# EAGLE board microDriver_v2 (EAGLE 8.3.1), part 1 of 2
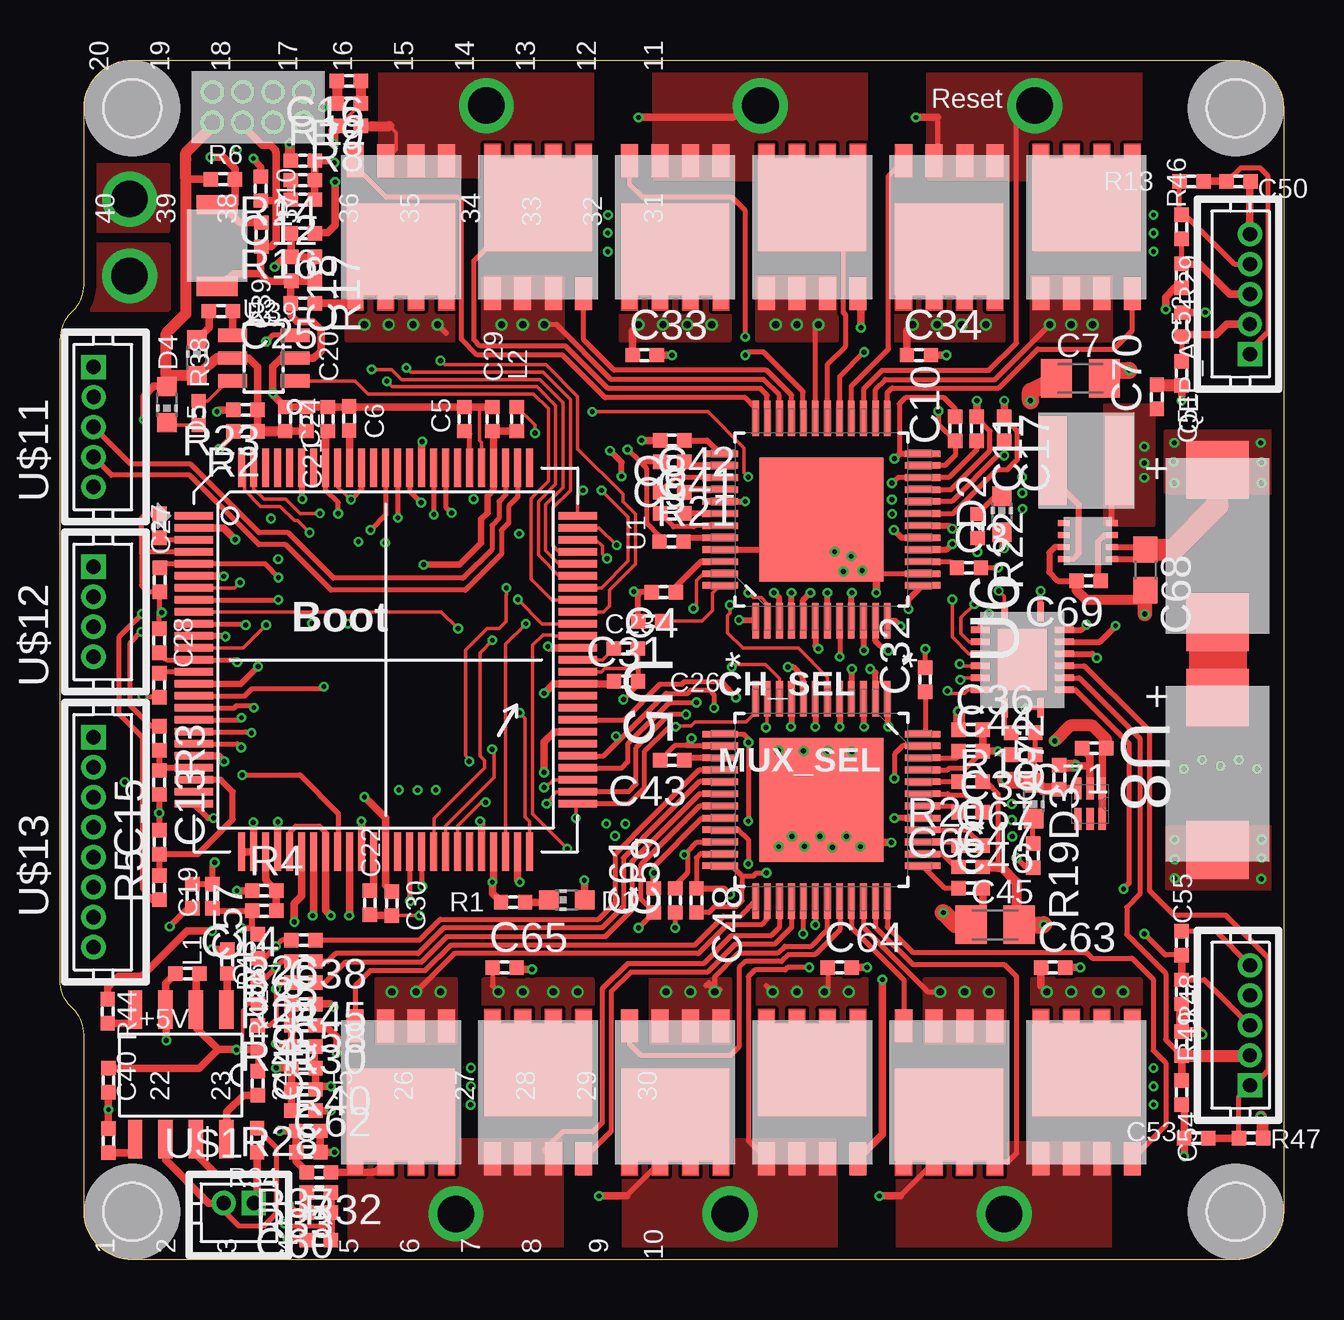
[diagram p3: board, top side]
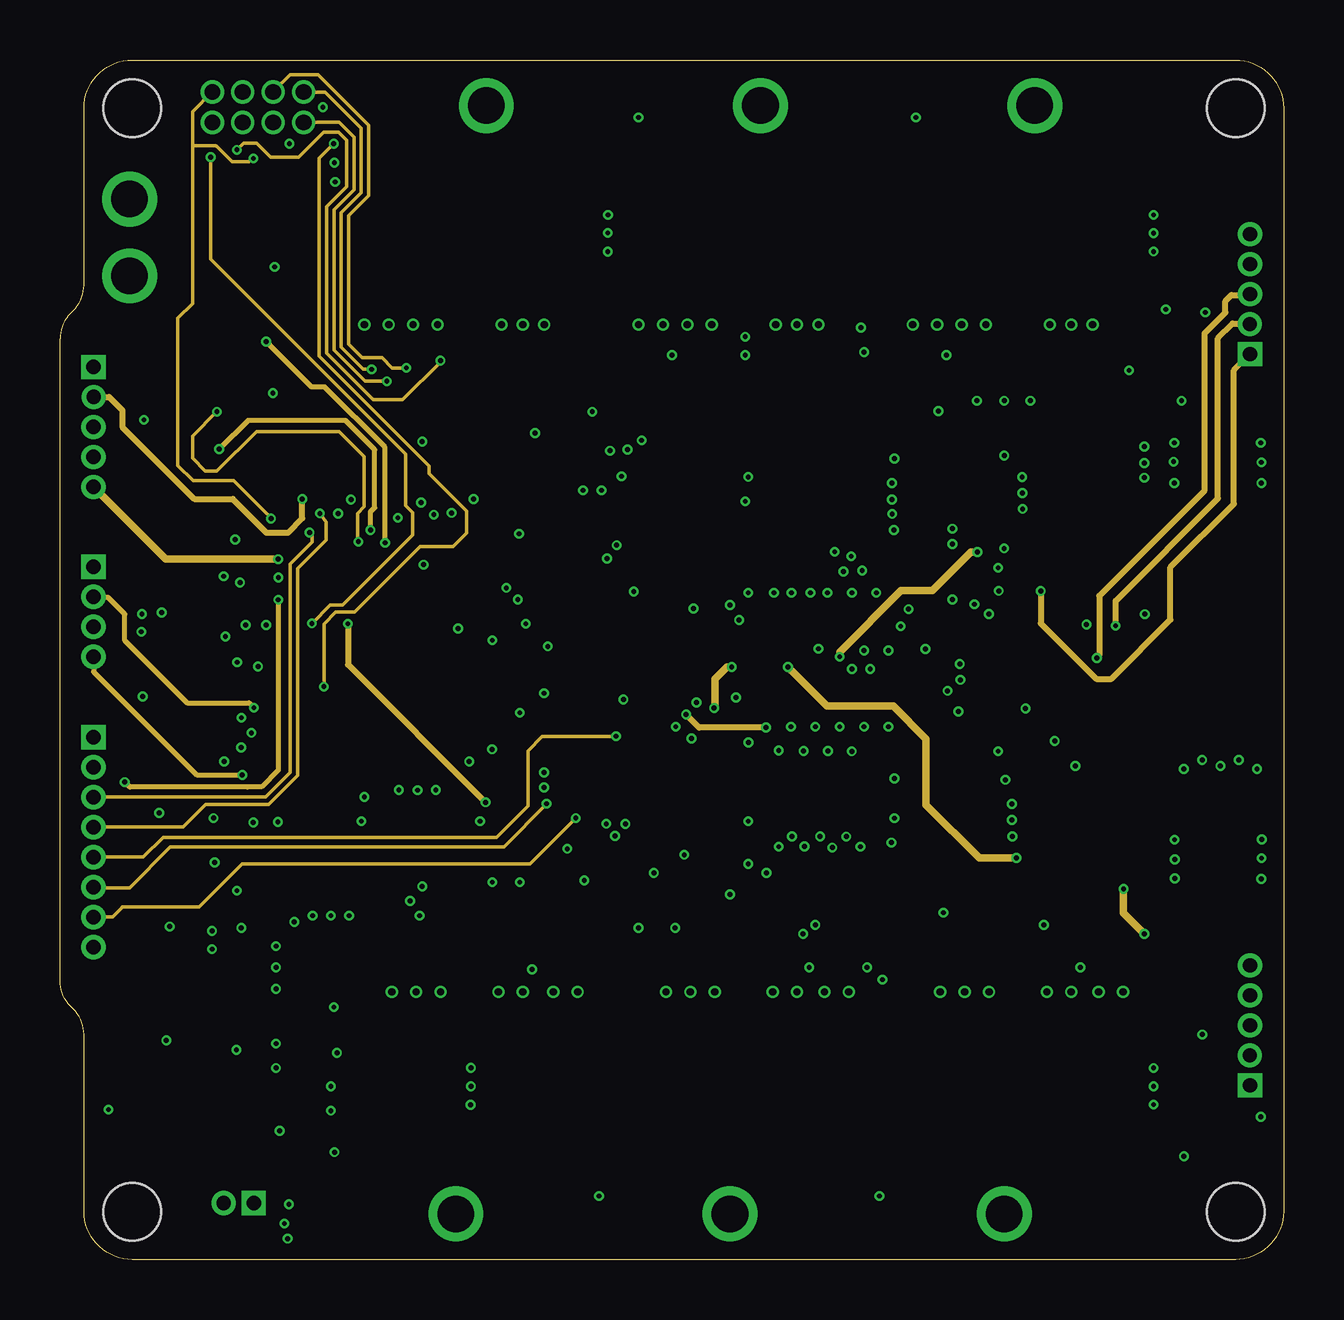
[diagram p4: board, inner layer ROUTE]
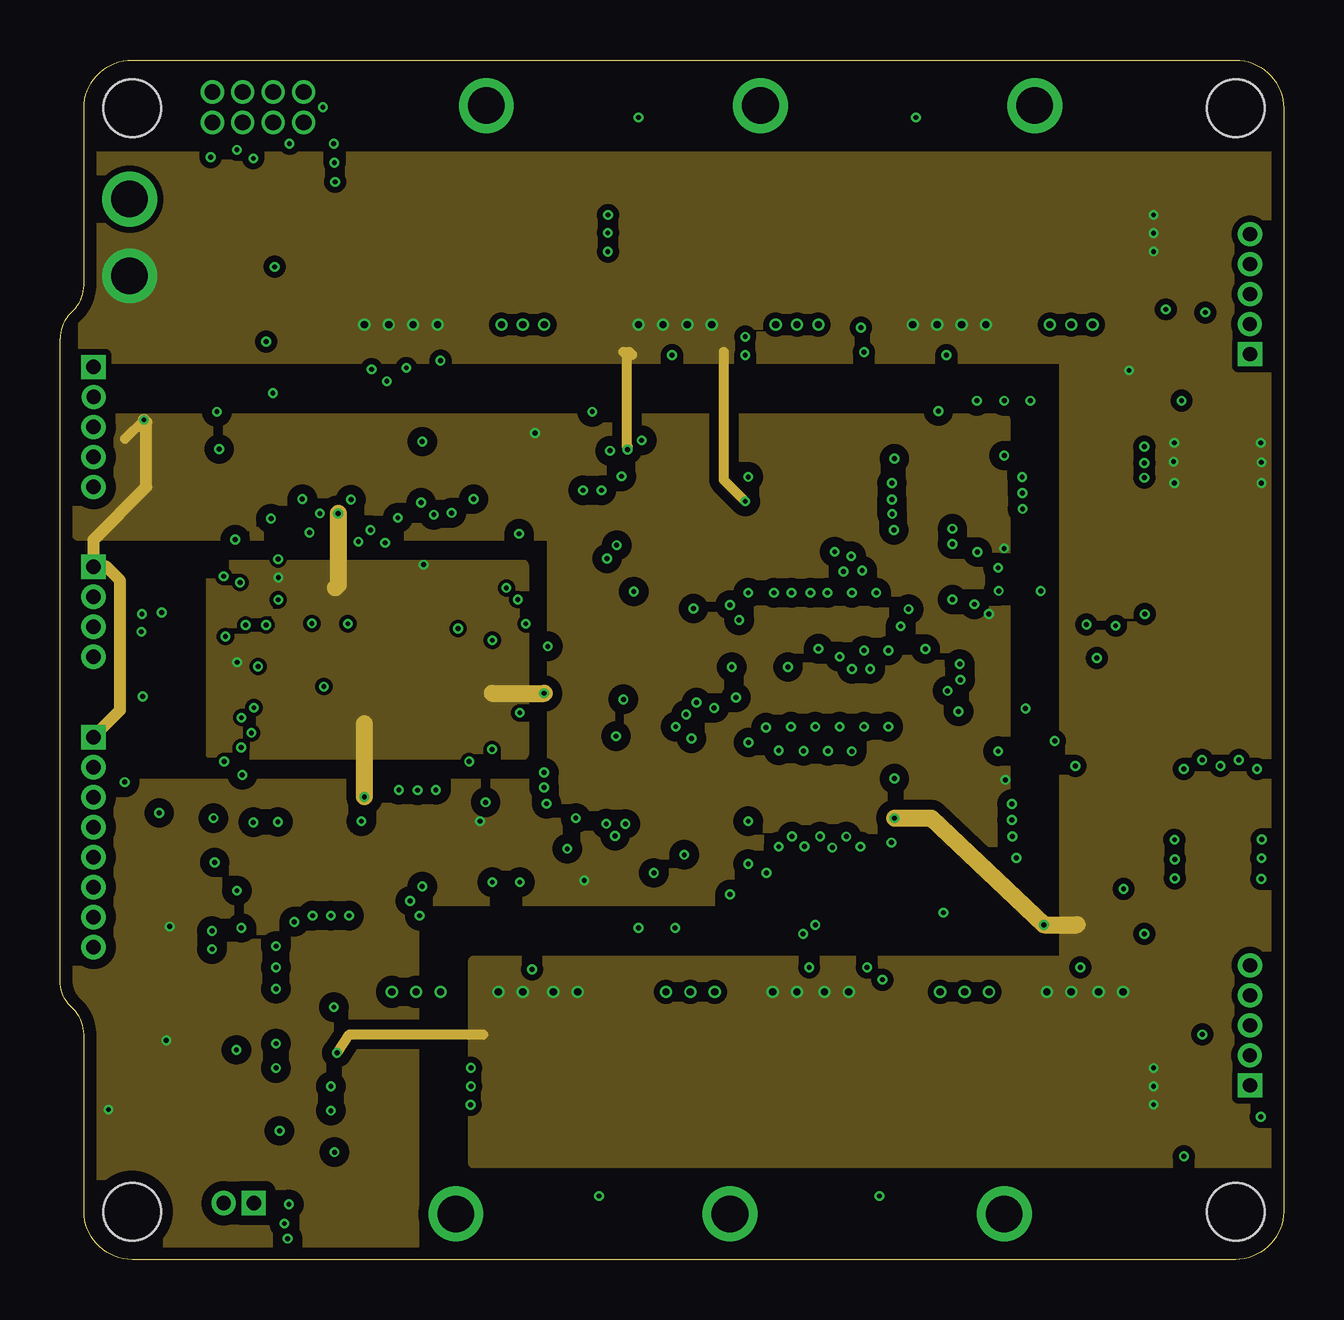
[diagram p5: board, inner layer VDD]
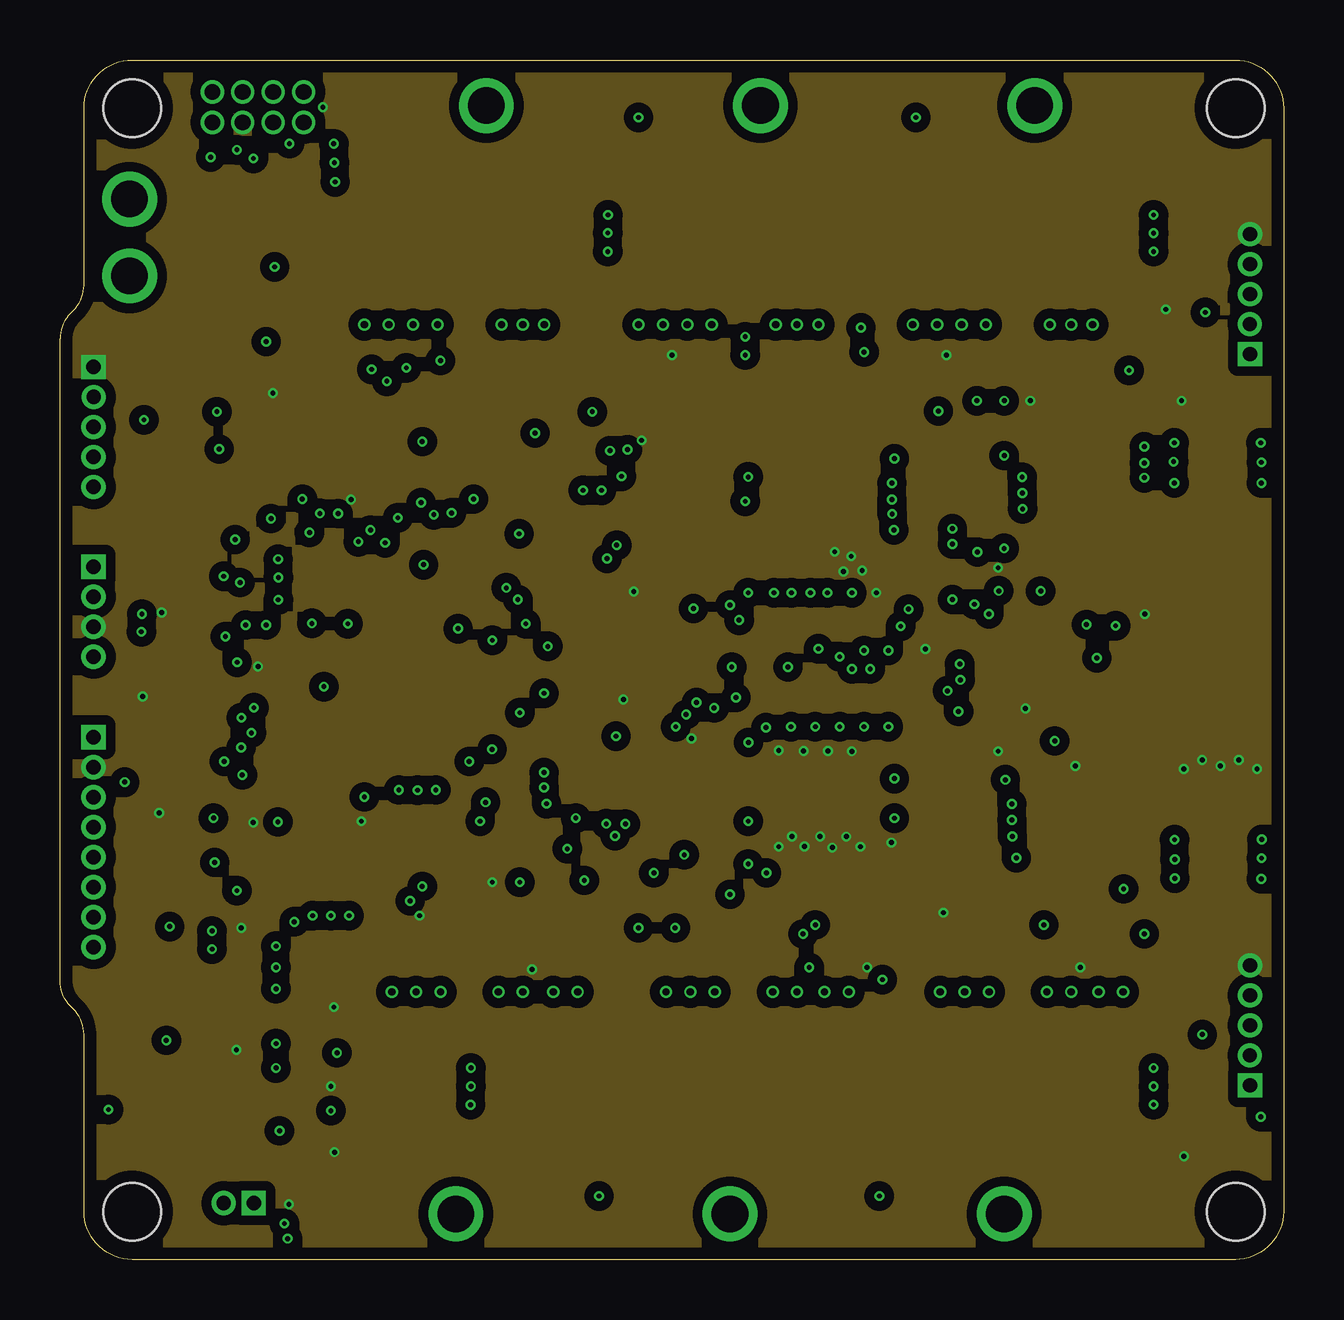
[diagram p6: board, inner layer GND]
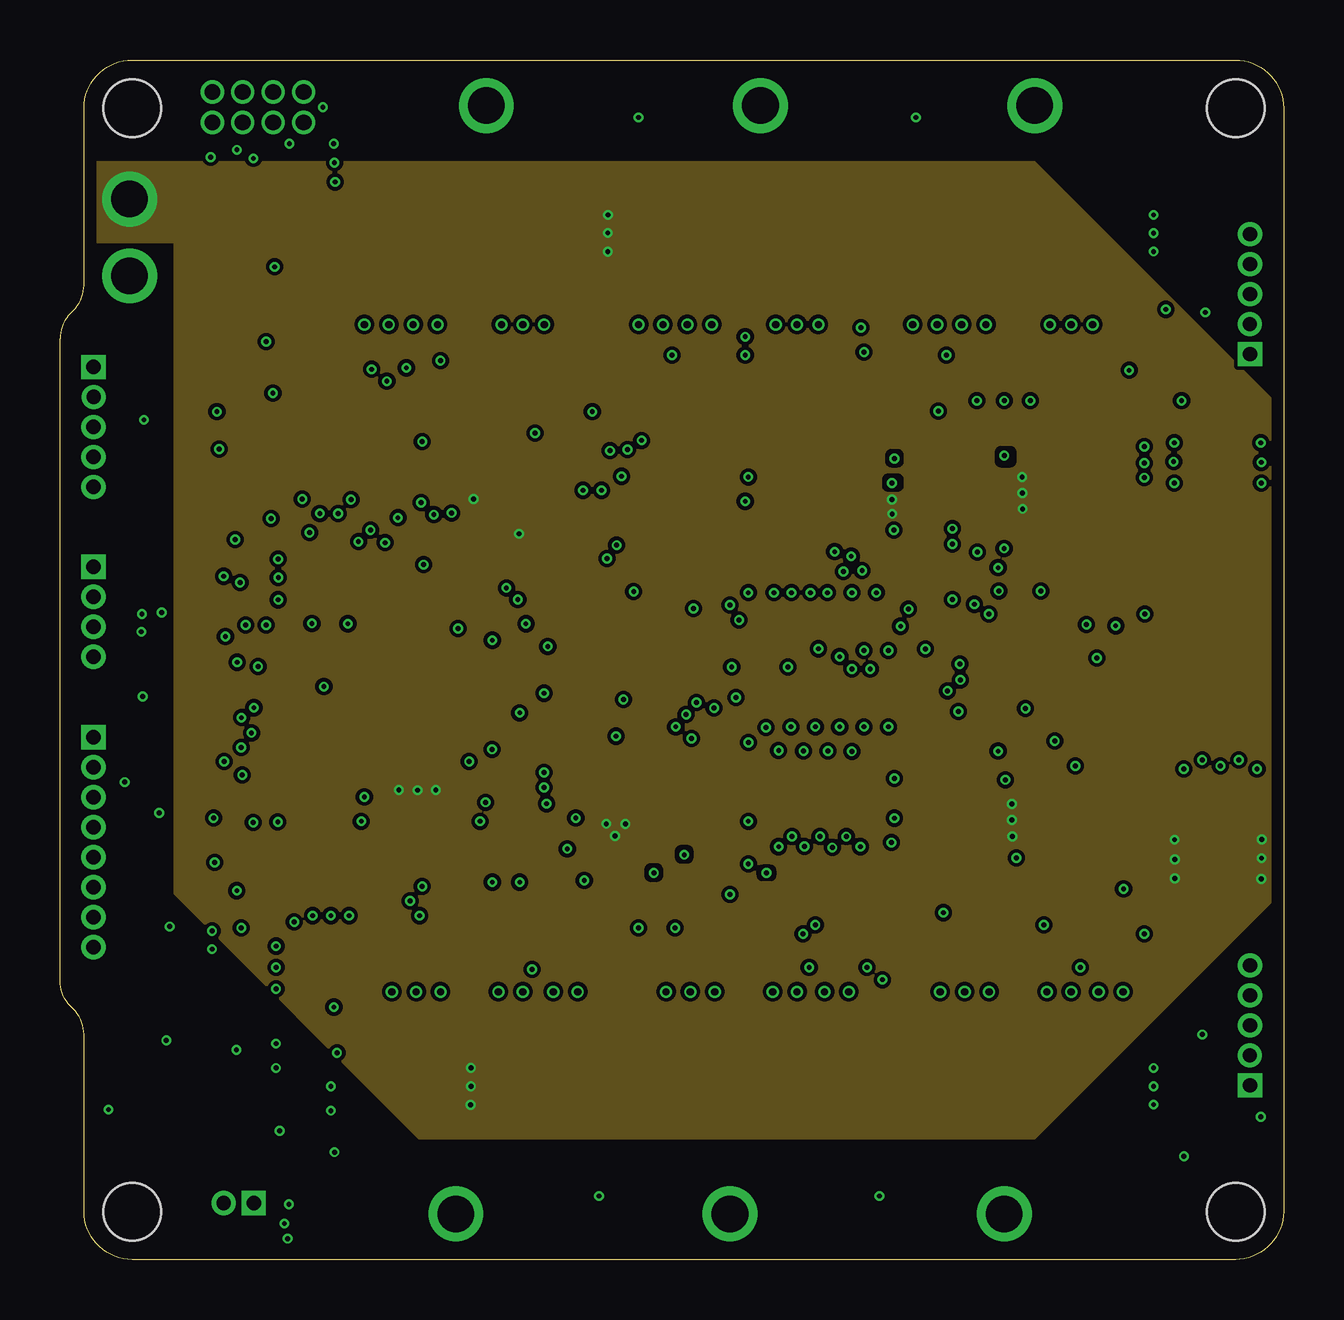
[diagram p7: board, inner layer AGND]
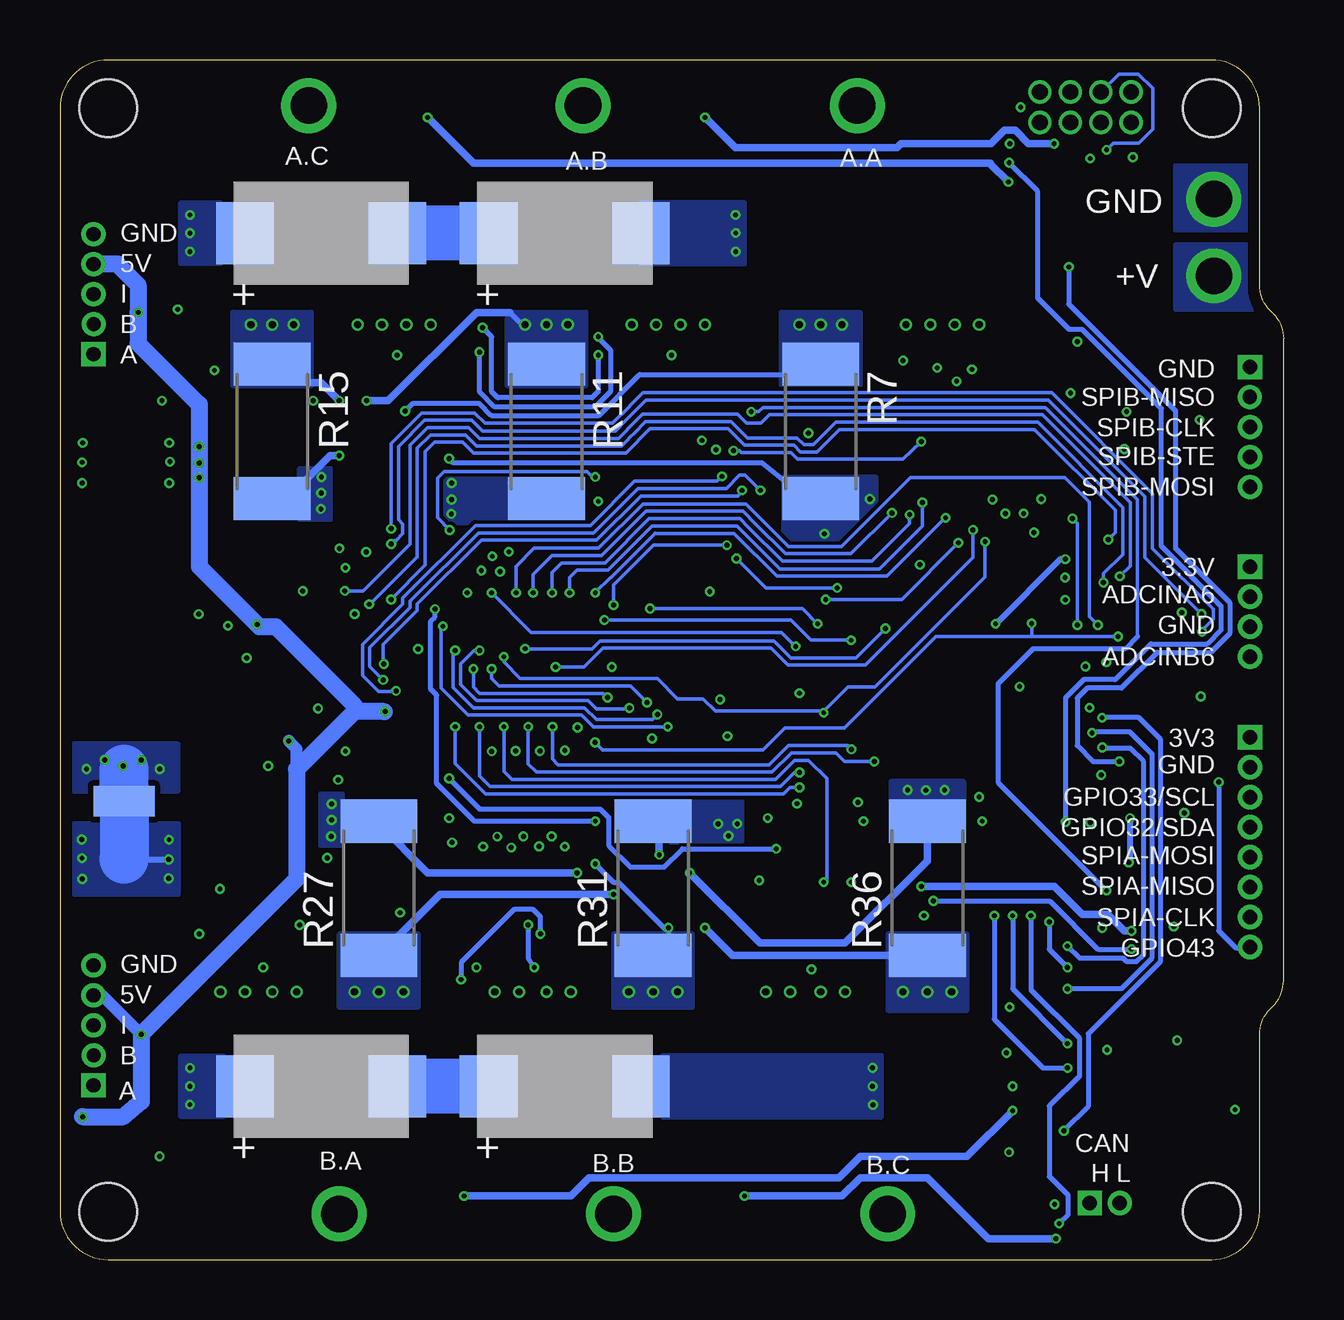
[diagram p8: board, bottom side, seen from below]

Size 51 x 50 mm. Coordinates in mm from the lower left corner, seen from the top.
Outline: 3,50 49,50 arc-90 51,48 51,2 arc-90 49,0 3,0 arc-90 1,2 1,9.38 arc45 0.56,10.44 0.44,10.56 arc-45 0,11.62 0,38.38 arc-45 0.44,39.44 0.56,39.56 arc45 1,40.62 1,48 arc-90 3,50
Copper layers (1*2*3*4*(5*16)): Top 0.035mm / dielectric 0.3mm / ROUTE 0.035mm / dielectric 0.3mm / VDD 0.035mm / dielectric 0.3mm / GND 0.035mm / dielectric 0.15mm / AGND 0.035mm / dielectric 0.2mm / Bottom 0.035mm
Design rules "default *": minimum track width 6mil, minimum drill 6mil, track to track 6mil, track to pad 6mil, pad to pad 5mil, via to via 8mil, smd to smd 5mil, copper to edge 20mil, drill to drill 10mil, minimum pad ring 3mil, minimum via ring 4mil, stop-mask expansion 2.5mil, vias tented up to drill 12mil, thermal gap 10mil
Net classes: 0 default: width 0.152 mm, drill 0.203 mm, clearance 0.152 mm
Holes 2.4 mm at 49,48 49,2 3,48 3,2

## Footprints (pad centres in the part's own frame; a part is rotated, then mirrored left to right if it is on the bottom)
B3U = smd 0.8 x 1.7: P$1 -1.7,0; P$2 1.7,0
C0402 = smd 0.6 x 0.6: 1 -0.5,0; 2 0.5,0
C0805K = smd 1.3 x 1.6: 1 -1,0; 2 1,0
C0603 = smd 1.1 x 1: 1 -0.85,0; 2 0.85,0
CHIP-LED0603 = smd 0.8 x 0.8: A 0,-0.75; C 0,0.75
4X4 = smd 1.2 x 3.7: P$1 -1.4,0; P$2 1.4,0
R0402 = smd 0.6 x 0.6: 1 -0.5,0; 2 0.5,0
AMP-MINITEK-8 = drill 0.65 pad 0.9: P$1 0,0; P$2 0,-1.27; P$3 1.27,0; P$4 1.27,-1.27; P$5 2.54,0; P$6 2.54,-1.27; P$7 3.81,0; P$8 3.81,-1.27
Q5B = smd 1.372 x 0.71: 1 2.77,-1.905; 2 2.77,-0.638; 3 2.77,0.638; 4 2.77,1.905 | smd 0.97 x 0.635: 5 -2.92,1.905; 6 -2.92,0.635; 7 -2.92,-0.635; 8 -2.92,-1.905 | smd 3.81 x 4.52: 9 -0.921,0
DF13-5P-1.25DSA = drill 0.6 pad 1.016 square: P$1 2.5,0.005 | drill 0.6 pad 1.016: P$2 1.25,-0.005; P$3 0,0; P$4 -1.25,0; P$5 -2.5,0
R2512 = smd 1.8 x 3.2: 1 -2.8,0; 2 2.8,0
M7343-CAP = smd 2.4 x 2.6: + -3.175,0; - 3.175,0
PQFP100 = smd 1.6 x 0.3: 1 -8,6; 2 -8,5.5; 3 -8,5; 4 -8,4.5; 5 -8,4; 6 -8,3.5; 7 -8,3; 8 -8,2.5; 9 -8,2; 10 -8,1.5; 11 -8,1; 12 -8,0.5; 13 -8,0; 14 -8,-0.5; 15 -8,-1; 16 -8,-1.5; 17 -8,-2; 18 -8,-2.5; 19 -8,-3; 20 -8,-3.5; 21 -8,-4; 22 -8,-4.5; 23 -8,-5; 24 -8,-5.5; 25 -8,-6; 51 8,-6; 52 8,-5.5; 53 8,-5; 54 8,-4.5; 55 8,-4; 56 8,-3.5; 57 8,-3; 58 8,-2.5; 59 8,-2; 60 8,-1.5; 61 8,-1; 62 8,-0.5; 63 8,0; 64 8,0.5; 65 8,1; 66 8,1.5; 67 8,2; 68 8,2.5; 69 8,3; 70 8,3.5; 71 8,4; 72 8,4.5; 73 8,5; 74 8,5.5; 75 8,6 | smd 0.3 x 1.6: 26 -6,-8; 27 -5.5,-8; 28 -5,-8; 29 -4.5,-8; 30 -4,-8; 31 -3.5,-8; 32 -3,-8; 33 -2.5,-8; 34 -2,-8; 35 -1.5,-8; 36 -1,-8; 37 -0.5,-8; 38 0,-8; 39 0.5,-8; 40 1,-8; 41 1.5,-8; 42 2,-8; 43 2.5,-8; 44 3,-8; 45 3.5,-8; 46 4,-8; 47 4.5,-8; 48 5,-8; 49 5.5,-8; 50 6,-8; 76 6,8; 77 5.5,8; 78 5,8; 79 4.5,8; 80 4,8; 81 3.5,8; 82 3,8; 83 2.5,8; 84 2,8; 85 1.5,8; 86 1,8; 87 0.5,8; 88 0,8; 89 -0.5,8; 90 -1,8; 91 -1.5,8; 92 -2,8; 93 -2.5,8; 94 -3,8; 95 -3.5,8; 96 -4,8; 97 -4.5,8; 98 -5,8; 99 -5.5,8; 100 -6,8
SOT23-6-DBV = smd 0.55 x 1.2: 1 -0.95,-1.3; 2 0,-1.3; 3 0.95,-1.3; 4 0.95,1.3; 5 0,1.3; 6 -0.95,1.3
SOIC8-PDSO = smd 0.6 x 1.6: P$1 0,0; P$2 1.27,0; P$3 2.54,0; P$4 3.81,0; P$5 3.81,5.4; P$6 2.54,5.4; P$7 1.27,5.4; P$8 0,5.4
VQFN-N16 = smd 0.8 x 0.28: 1 -2,-0.75; 8 2,-0.75; 9 2,0.75; 16 -2,0.75 | smd 0.28 x 0.8: 2 -1.25,-1.75; 3 -0.75,-1.75; 4 -0.25,-1.75; 5 0.25,-1.75; 6 0.75,-1.75; 7 1.25,-1.75; 10 1.25,1.75; 11 0.75,1.75; 12 0.25,1.75; 13 -0.25,1.75; 14 -0.75,1.75; 15 -1.25,1.75 | smd 2.55 x 2.05: THM 0,0
HTQFP-48 = smd 1.473 x 0.279: 1 -4.216,2.743; 2 -4.216,2.261; 3 -4.216,1.753; 4 -4.216,1.245; 5 -4.216,0.762; 6 -4.216,0.254; 7 -4.216,-0.254; 8 -4.216,-0.762; 9 -4.216,-1.245; 10 -4.216,-1.753; 11 -4.216,-2.261; 12 -4.216,-2.743; 25 4.216,-2.743; 26 4.216,-2.261; 27 4.216,-1.753; 28 4.216,-1.245; 29 4.216,-0.762; 30 4.216,-0.254; 31 4.216,0.254; 32 4.216,0.762; 33 4.216,1.245; 34 4.216,1.753; 35 4.216,2.261; 36 4.216,2.743 | smd 0.279 x 1.473: 13 -2.743,-4.216; 14 -2.261,-4.216; 15 -1.753,-4.216; 16 -1.245,-4.216; 17 -0.762,-4.216; 18 -0.254,-4.216; 19 0.254,-4.216; 20 0.762,-4.216; 21 1.245,-4.216; 22 1.753,-4.216; 23 2.261,-4.216; 24 2.743,-4.216; 37 2.743,4.216; 38 2.261,4.216; 39 1.753,4.216; 40 1.245,4.216; 41 0.762,4.216; 42 0.254,4.216; 43 -0.254,4.216; 44 -0.762,4.216; 45 -1.245,4.216; 46 -1.753,4.216; 47 -2.261,4.216; 48 -2.743,4.216 | smd 5.17 x 5.17: 49 0,0
TDFN-8 = smd 0.5 x 0.25: P$1 -1,0.75; P$2 -1,0.25; P$3 -1,-0.25; P$4 -1,-0.75; P$5 1,-0.75; P$6 1,-0.25; P$7 1,0.25; P$8 1,0.75
SON50P150X150X80-6N = smd 0.914 x 0.305: 1 -0.635,0.508; 2 -0.635,0; 3 -0.635,-0.508; 4 0.635,-0.508; 5 0.635,0; 6 0.635,0.508
DF13-2P-1.25DSA = drill 0.6 pad 1.016 square: P$1 0.625,0 | drill 0.6 pad 1.016: P$2 -0.625,0
GND-AGND = smd 1.27 x 2.54: P$1 0,0; P$2 0,0
BLDC_PAD = drill 1.524: P$1 0,0
DF13-4P-1.25DSA = drill 0.6 pad 1.016 square: P$1 1.875,0 | drill 0.6 pad 1.016: P$2 0.625,0; P$3 -0.625,0; P$4 -1.875,0
DF13-8P-1.25DSA = drill 0.6 pad 1.016 square: P$1 4.375,0 | drill 0.6 pad 1.016: P$2 3.125,0; P$3 1.875,0; P$4 0.625,0; P$5 -0.625,0; P$6 -1.875,0; P$7 -3.125,0; P$8 -4.375,0

## Placement (x,y rotation side)
B1  B3U  [B3U]  6.55,42.27 90 top
C1  2.2u  [C0402]  4.14,30.58 90 top
C2  2.2u  [C0402]  4.14,23.94 270 top
C3  1u  [C0402]  37.88,28.84 0 top
C4  1u  [C0402]  25.16,27.82 180 top
C5  2.2u  [C0402]  16.85,35.03 90 top
C6  2.2u  [C0402]  12.05,35.06 90 top
C7  4.7u  [C0805K]  42.53,36.73 0 top
C8  1u  [C0402]  25.52,34.14 180 top
C9  2.2u  [C0402]  25.52,33.26 180 top
C10  1000p  [C0402]  37.31,34.63 90 top
C11  1000p  [C0402]  38.21,34.63 270 top
C12  0.1u  [C0402]  10.12,44.18 180 top
C13  2200p  [C0402]  4.14,19.89 270 top
C14  2200p  [C0402]  8.52,14.54 180 top
C15  2200p  [C0402]  4.15,17.4 90 top
C16  0.1u  [C0402]  12.05,49.12 180 top
C17  1000p  [C0402]  39.36,34.63 270 top
C18  0.1u  [C0402]  9.64,41.28 270 top
C19  2.2u  [C0402]  6.36,15.15 270 top
C20  2.2u  [C0402]  11.16,35.03 90 top
C21  2.2u  [C0402]  10.28,35.03 90 top
C22  2.2u  [C0402]  12.91,14.87 270 top
C23  2.2u  [C0402]  23.59,25.47 0 top
C24  0.1u  [C0402]  9.39,35.03 90 top
C25  0.47uF  [C0402]  10.12,39.86 180 top
C26  2.2u  [C0402]  23.59,24.1 0 top
C27  2.2u  [C0402]  4.16,28.33 270 top
C28  2.2u  [C0402]  4.14,25.8 90 top
C29  2.2u  [C0402]  18.02,35.03 90 top
C30  2.2u  [C0402]  13.83,14.84 270 top
C31  1u  [C0402]  24.6,26.61 180 top
C32  1u  [C0402]  36.06,24.17 90 top
C33  0.47uF  [C0402]  24.37,37.7 0 top
C34  0.47uF  [C0402]  35.8,37.7 0 top
C35  0.1u  [C0402]  40.15,21.04 180 top
C36  0.1u  [C0402]  37.96,22.08 0 top
C37  0.1u  [C0402]  5.32,11.92 0 top
C38  0.1u  [C0402]  10.15,10.65 0 top
C39  0.1u  [C0402]  8.39,42.72 270 top
C40  0.1u  [C0402]  2.02,7.47 90 top
C41  .047u  [C0402]  25.52,31.1 0 top
C42  .047u  [C0402]  25.52,31.98 0 top
C43  1u  [C0402]  25.52,20.81 180 top
C44  1u  [C0402]  37.96,21.19 0 top
C45  4.7u  [C0805K]  38.98,13.95 0 top
C46  1u  [C0402]  37.96,15.47 0 top
C47  2.2u  [C0402]  37.96,16.36 0 top
C48  1000p  [C0402]  26.53,14.97 270 top
C49  2200p  [C0402]  8.24,9.25 270 top
C50  0.001u  [C0402]  49.12,44.94 0 top
C51  0.001u  [C0402]  46.75,36.94 270 top
C52  0.001u  [C0402]  46.75,41 270 top
C53  0.001u  [C0402]  47.36,5.06 180 top
C54  0.001u  [C0402]  46.75,6.97 270 top
C55  0.001u  [C0402]  46.75,13.19 90 top
C56  2200p  [C0402]  8.24,11.16 270 top
C57  2200p  [C0402]  8.24,13.06 90 top
C58  0.1u  [C0402]  10.15,7.98 0 top
C59  1000p  [C0402]  25.64,14.97 90 top
C60  0.1u  [C0402]  10.8,1.96 180 top
C61  1000p  [C0402]  24.75,14.97 90 top
C62  0.1u  [C0402]  10.35,4.48 0 top
C63  0.47uF  [C0402]  41.39,12.17 0 top
C64  0.47uF  [C0402]  32.5,12.17 0 top
C65  0.47uF  [C0402]  18.53,12.17 0 top
C66  .047u  [C0402]  37.96,18.65 180 top
C67  .047u  [C0402]  37.96,17.25 0 top
C68  1uF  [C0603]  45.24,28.74 270 top
C69  1uF  [C0402]  42.87,28.29 180 top
C70  10uF  [C0402]  45.72,35.95 90 top
C71  1uF  [C0402]  43.1,21.31 180 top
C72  1uF  [C0402]  41.65,20.1 90 top
D1  PWR  [CHIP-LED0603]  21.12,14.99 90 top
D2  ERROR  [CHIP-LED0603]  39.26,31.06 0 top
D3  ERROR  [CHIP-LED0603]  40.58,19.13 180 top
D4  [CHIP-LED0603]  4.46,35.64 180 top
D5  [CHIP-LED0603]  5.71,37.59 0 top
I1  NR4018  [4X4]  42.77,33.3 0 top
L1  BKP1005HS221-T  [R0402]  5.52,15.15 270 top
L2  BLM15PD600SN1D  [R0402]  19.04,35.03 90 top
M1  AMP-8  [AMP-MINITEK-8]  6.35,48.67 0 top
Q1  CSD18540  [Q5B]  14.21,43.03 90 top
Q2  CSD18540  [Q5B]  25.64,43.03 90 top
Q3  CSD18540  [Q5B]  37.07,43.03 90 top
Q4  CSD18540  [Q5B]  19.93,43.03 270 top
Q5  CSD18540  [Q5B]  31.36,43.03 270 top
Q6  CSD18540  [Q5B]  42.79,43.03 270 top
Q7  CSD18540  [Q5B]  42.79,6.97 270 top
Q8  CSD18540  [Q5B]  37.07,6.97 90 top
Q9  CSD18540  [Q5B]  31.36,6.97 270 top
Q10  CSD18540  [Q5B]  25.64,6.97 90 top
Q11  CSD18540  [Q5B]  19.93,6.97 270 top
Q12  CSD18540  [Q5B]  14.21,6.97 90 top
QEP_A  DF13-5P-1.25DSA  [DF13-5P-1.25DSA]  49.6,40.24 270 top
QEP_B  DF13-5P-1.25DSA  [DF13-5P-1.25DSA]  49.6,9.76 270 top
R1  120  [R0402]  18.89,14.89 0 top
R2  10k  [R0402]  7.74,34.52 180 top
R3  56  [R0402]  4.14,21.73 270 top
R4  56  [R0402]  8.52,15.38 0 top
R5  56  [R0402]  4.14,15.5 90 top
R6  2.2k  [R0402]  6.79,45.03 180 top
R7  0.007  [R2512]  19.29,34.52 270 bottom
R8  62.0k  [R0402]  12.05,47.24 180 top
R9  4.99k  [R0402]  12.05,48.18 180 top
R10  2.2k  [R0402]  8.37,44.63 90 top
R11  0.007  [R2512]  30.72,34.52 270 bottom
R12  62.0k  [R0402]  10.12,45.8 0 top
R13  1K  [R0402]  47.16,44.94 0 top
R14  4.99k  [R0402]  10.12,44.99 180 top
R15  0.007  [R2512]  42.15,34.52 270 bottom
R16  62.0k  [R0402]  10.12,42.77 180 top
R17  4.99k  [R0402]  10.63,41.28 270 top
R18  2.2k  [R0402]  40.15,21.95 180 top
R19  330  [R0402]  40.55,16.84 270 top
R20  100  [R0402]  37.96,19.92 180 top
R21  100  [R0402]  25.49,29.93 0 top
R22  330  [R0402]  38.25,30.57 270 top
R23  10k  [R0402]  7.74,35.41 180 top
R24  56  [R0402]  10.15,11.54 180 top
R25  56  [R0402]  10.15,12.43 180 top
R26  56  [R0402]  10.15,13.32 180 top
R27  0.007  [R2512]  37.71,15.47 90 bottom
R28  62.0k  [R0402]  10.15,6.2 180 top
R29  1K  [R0402]  46.75,38.97 270 top
R30  4.99k  [R0402]  10.15,7.09 0 top
R31  0.007  [R2512]  26.28,15.47 90 bottom
R32  62.0k  [R0402]  10.8,0.82 0 top
R33  4.99k  [R0402]  10.8,2.8 180 top
R34  120  [R0402]  8.22,4.97 270 top
R35  10K  [R0402]  2.02,4.96 90 top
R36  0.007  [R2512]  14.85,15.47 90 bottom
R37  62.0k  [R0402]  10.8,3.64 180 top
R38  330  [R0402]  5.78,35.28 270 top
R39  330  [R0402]  6.71,39.53 180 top
R40  4.99k  [R0402]  10.35,5.37 0 top
R41  62.0k  [R0402]  10.15,9.76 180 top
R42  10K  [R0402]  8.24,7.35 90 top
R43  0R  [R0402]  6.97,12.43 90 top
R44  0R  [R0402]  1.99,10.35 90 top
R45  4.99k  [R0402]  10.15,8.87 0 top
R46  1K  [R0402]  46.75,43.03 270 top
R47  1K  [R0402]  49.65,5.06 180 top
R48  1K  [R0402]  46.75,9 270 top
R49  1K  [R0402]  46.75,11.16 90 top
T1  7343-CAP  [M7343-CAP]  40.12,42.78 0 bottom
T2  7343-CAP  [M7343-CAP]  29.96,42.78 0 bottom
T3  7343-CAP  [M7343-CAP]  40.12,7.22 0 bottom
T4  7343-CAP  [M7343-CAP]  29.96,7.22 0 bottom
T5  7343-CAP  [M7343-CAP]  48.25,29.75 270 top
T6  7343-CAP  [M7343-CAP]  48.25,20.25 270 top
U1  TMS320F28069MPZT  [PQFP100]  13.58,25 0 top
U2  SN74LVC2G07  [SOT23-6-DBV]  8.5,37.57 90 top
U3  SN65HVD234D  [SOIC8-PDSO]  6.94,10.41 180 top
U4  TXB0106  [VQFN-N16]  40.12,25 270 top
U5  DRV8305  [HTQFP-48]  31.74,19.16 270 top
U6  DRV8305  [HTQFP-48]  31.74,30.84 90 top
U7  MAX15062  [TDFN-8]  42.85,29.96 180 top
U8  TLV70033DSER  [SON50P150X150X80-6N]  42.94,18.99 270 top
U$1  DF13-2P-1.25DSA  [DF13-2P-1.25DSA]  7.45,2.35 0 top
U$2  GND-AGND  [GND-AGND]  48.32,19.1 90 bottom
U$3  BLDC_PAD  [BLDC_PAD]  39.36,1.9 0 top
U$4  BLDC_PAD  [BLDC_PAD]  27.93,1.9 0 top
U$5  BLDC_PAD  [BLDC_PAD]  16.5,1.9 0 top
U$6  BLDC_PAD  [BLDC_PAD]  17.77,48.1 0 top
U$7  BLDC_PAD  [BLDC_PAD]  29.2,48.1 0 top
U$8  BLDC_PAD  [BLDC_PAD]  40.63,48.1 0 top
U$9  BLDC_PAD  [BLDC_PAD]  2.9,41 0 top
U$10  BLDC_PAD  [BLDC_PAD]  2.9,44.2 0 top
U$11  DF13-5P-1.25DSA  [DF13-5P-1.25DSA]  1.4,34.7 90 top
U$12  DF13-4P-1.25DSA  [DF13-4P-1.25DSA]  1.4,27 90 top
U$13  DF13-8P-1.25DSA  [DF13-8P-1.25DSA]  1.4,17.4 90 top